# Altium schematic sheet Sallen.SchDoc
size A
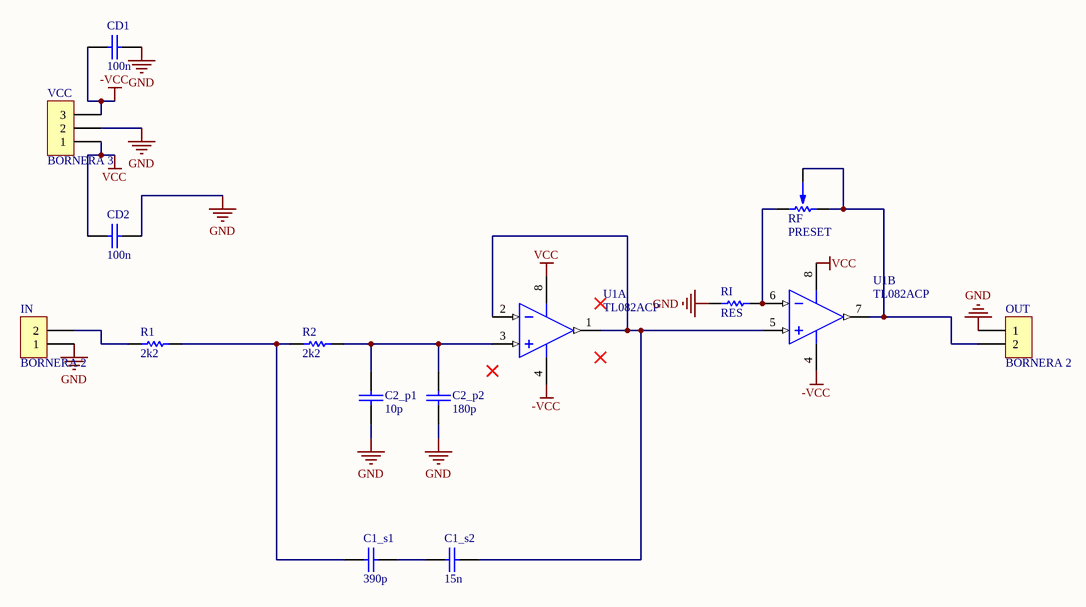
[diagram p0: Sallen.SchDoc]

## Parts
C1_s1  390p  [0805]
C1_s2  15n  [0805]
C2_p1  10p  [0805]
C2_p2  180p  [0805]
CD1  100n  [0805]
CD2  100n  [0805]
IN  BORNERA 2  [BORNERA2]
OUT  BORNERA 2  [BORNERA2]
R1  2k2  [0805]
R2  2k2  [0805]
RF  PRESET  [PRESET V]
RI  RES  [0805]
U1  TL082ACP  [TI-P8]  (parts A,B of 2)
VCC  BORNERA 3  [BORNERA3]

## Nets
-VCC: CD1.1 U1.4(VCC-) VCC.3
GND: C2_p1.2 C2_p2.2 CD1.2 CD2.2 IN.1 OUT.1 RI.1 VCC.2
VCC: CD2.1 U1.8(VCC+) VCC.1
NetC1_s1_1: C1_s1.1 R1.1 R2.2
NetC1_s1_2: C1_s1.2 C1_s2.1
NetC1_s2_2: C1_s2.2 U1.1(OUT1) U1.2(IN1-) U1.5(IN2+)
NetC2_p1_1: C2_p1.1 C2_p2.1 R2.1 U1.3(IN1+)
NetIN_2: IN.2 R1.2
NetOUT_2: OUT.2 RF.2 RF.3 U1.7(OUT2)
NetRF_1: RF.1 RI.2 U1.6(IN2-)

## Library data of the parts
C1_s1 C1_s2 C2_p1 C2_p2 CD1 CD2 = CAP
R1 R2 = RES
U1 = TL082ACP: JFET-Input Operational Amplifier, 7 to 36 V, 0 to 70 degC, 8-pin DIP (P8), Pb-Free (RoHS); Manufacturer: Texas Instruments; CMRR(Min)(dB): 75; GBW(Typ)(MHz): 3; IIB(Max)(pA): 200; Iq per channel(Max)(mA): 2.8; Number of Channels: 2; Offset Drift(Typ)(uV/C): 18; Rating: Catalog; Slew Rate(Typ)(V/us): 13; Sub Family: General Purpose Amplifier, High Supply Voltage Amplifier (>=30V); Total Supply Voltage(Max)(+5V is 5, +/-5V is 10): 36; Total Supply Voltage(Min)(+5V is 5, +/-5V is 10): 7; Vio (25C)(Max)(mV): 6; DatasheetVersion: SLOS081G; PackageVersion: 4040082/E, 04/2010; PackageReference: P8; PackageDescription: 8-Pin Plastic In-Line, Body 9.59 x 6.35 mm, Pitch 2.54 mm; Supplier 1: Digi-Key; Supplier Part Number 1: 296-1778-5-ND; Supplier 2: Farnell; Supplier Part Number 2: 1103189; Supplier 3: Newark; Supplier Part Number 3: 08F9330; Supplier 4: Mouser; Supplier Part Number 4: 595-TL082ACP; Eco-Plan: Pb-Free (RoHS); Vn at 1kHz(Typ)(nV/rtHz): 18; Mounting Technology: Through Hole; Code_JEDEC: MS-001; PartNumber: TL082ACP; ComponentLink1Description: Manufacturer URL; ComponentLink1URL: http://www.ti.com/; ComponentLink2Description: Datasheet; ComponentLink2URL: http://www.ti.com/lit/ds/symlink/tl082a.pdf; ComponentLink3Description: Package Specification; ComponentLink3URL: http://www.ti.com/litv/pdf/mpdi001b